# Altium schematic sheet MCU009A_Connector+IO.SchDoc: Connector+IO
size 431 x 279 mm; Date: Not shown in title block; ApprovedBy: Not shown in title block; CheckedBy: Not shown in title block; Author: Not shown in title block; CompanyName: Not shown in title block; Engineer: Not shown in title block; Organization: Not shown in title block; Address1: Not shown in title block; Address2: Not shown in title block; Address3: Not shown in title block; Address4: Not shown in title block; DocumentNumber: 2; Revision: Use project parameter SCH_Rev; SheetNumber: 2; SheetTotal: 7; PageSetup: Record=PageOptions|CenterHorizontal=True|CenterVertical=True|PrintScale=1.00|XCorrection=1.00|YCorrection=1.00|PrintKind=0|BorderSize=5000000|LeftOffset=0|BottomOffset=0|Orientation=2|PaperLength=1000|PaperWidth=1000|Scale=100|PaperSource=15|PrintQuality=600|MediaType=1|DitherType=10|PaperKind=Letter|PrintScaleMode=1; CurrentTime: Not shown in title block; CurrentDate: Not shown in title block; Time: Not shown in title block; DocumentFullPathAndName: Not shown in title block; DocumentName: Not shown in title block; ModifiedDate: Not shown in title block; ImagePath: Not shown in title block
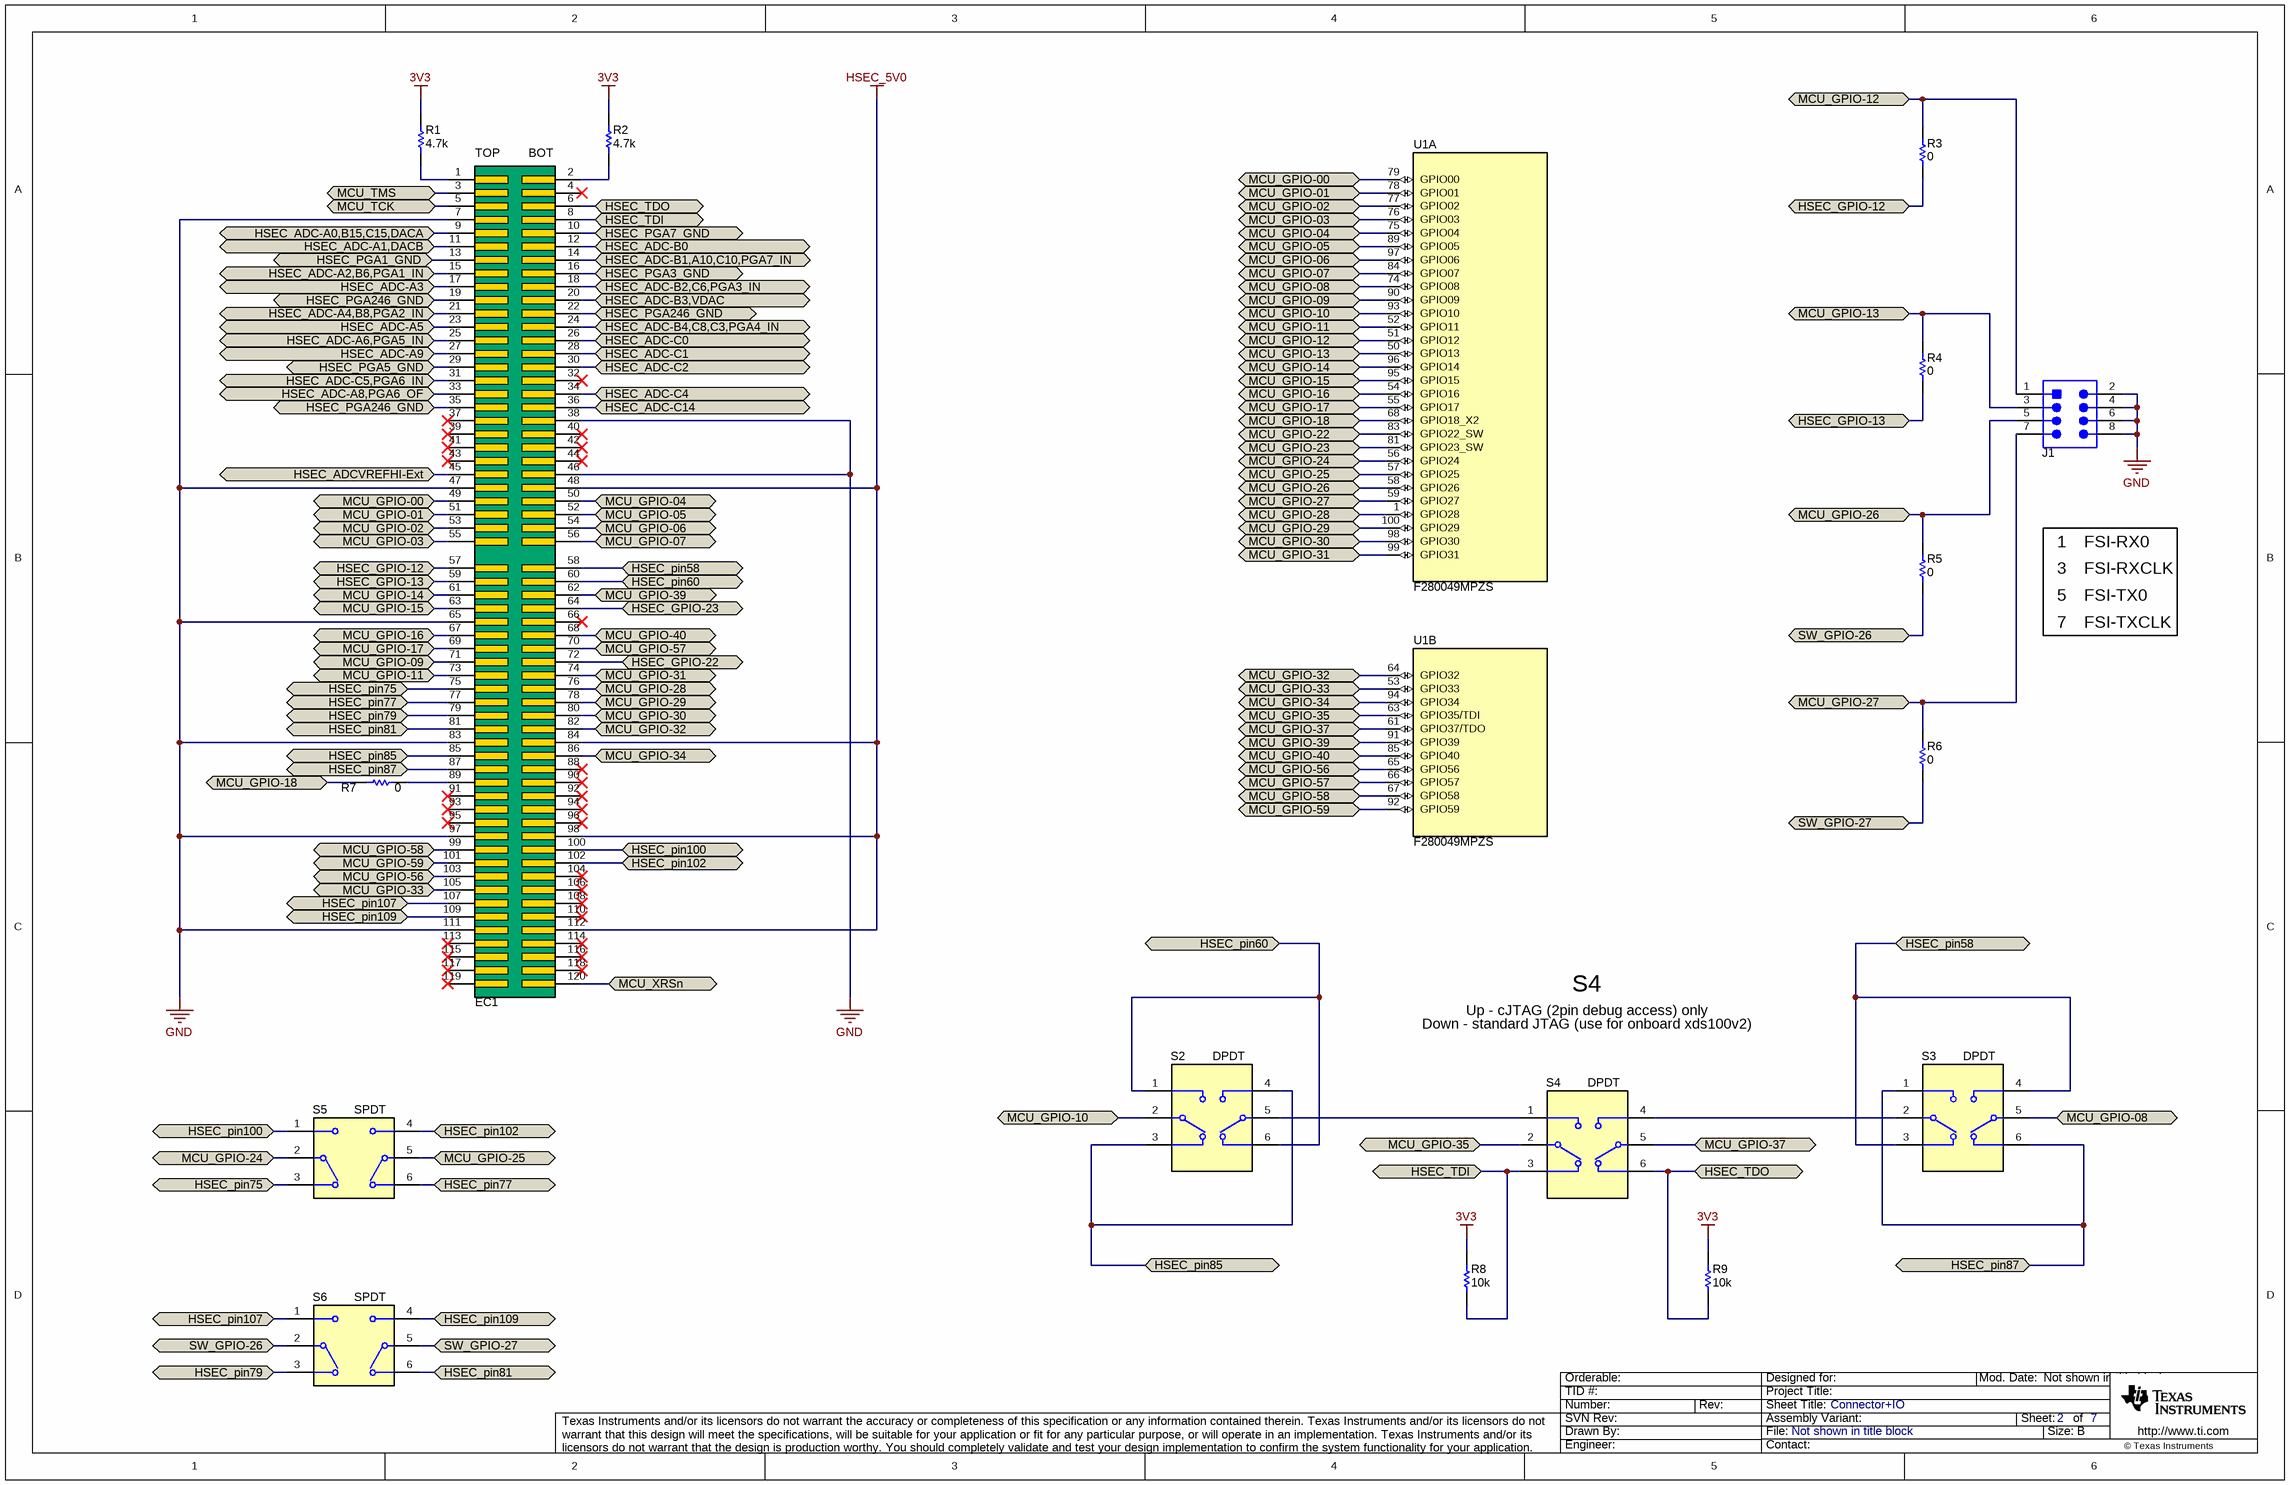
[diagram p0: MCU009A_Connector+IO.SchDoc]

## Parts
EC1  controlCARD-120HSEC_Edge  [controlCARD-120HSEC_Edge]  (value not drawn)  (no BOM)
J1  TMM-104-01-T-D  [Samtec_TMM-104-01-x-D]  (value not drawn)
R1  ValueDisplayed: 4.7k  [0402]  (hidden comment: CRCW04024K70JNED)
R2  ValueDisplayed: 4.7k  [0402]  (hidden comment: CRCW04024K70JNED)
R3  ValueDisplayed: 0  [0603]  (hidden comment: CRCW06030000Z0EA)
R4  ValueDisplayed: 0  [0603]  (hidden comment: CRCW06030000Z0EA)
R5  ValueDisplayed: 0  [0603]  (hidden comment: CRCW06030000Z0EA)
R6  ValueDisplayed: 0  [0603]  (hidden comment: CRCW06030000Z0EA)
R7  ValueDisplayed: 0  [0603]  (hidden comment: CRCW06030000Z0EA)
R8  ValueDisplayed: 10k  [0402]  (hidden comment: CRCW040210K0JNED)
R9  ValueDisplayed: 10k  [0402]  (hidden comment: CRCW040210K0JNED)
S2  Circuit: DPDT  [SW_CAS-220TA]  (hidden comment: CAS-220TA)
S3  Circuit: DPDT  [SW_CAS-220TA]  (hidden comment: CAS-220TA)
S4  Circuit: DPDT  [SW_CAS-220TA]  (hidden comment: CAS-220TA)
S5  Circuit: SPDT  [SW_CAS-D20TA]  (hidden comment: CAS-D20TA)
S6  Circuit: SPDT  [SW_CAS-D20TA]  (hidden comment: CAS-D20TA)
U1  F280049MPZS  [PZ0100A_N]  (parts A,B of 5)

## Ports
HSEC_ADC-A0,B15,C15,DACA (bidir), HSEC_ADC-A1,DACB (bidir), HSEC_ADC-A2,B6,PGA1_IN (bidir), HSEC_ADC-A3 (bidir), HSEC_ADC-A4,B8,PGA2_IN (bidir), HSEC_ADC-A5 (bidir), HSEC_ADC-A6,PGA5_IN (bidir), HSEC_ADC-A8,PGA6_OF (bidir), HSEC_ADC-A9 (bidir), HSEC_ADC-B0 (bidir), HSEC_ADC-B1,A10,C10,PGA7_IN (bidir), HSEC_ADC-B2,C6,PGA3_IN (bidir), HSEC_ADC-B3,VDAC (bidir), HSEC_ADC-B4,C8,C3,PGA4_IN (bidir), HSEC_ADC-C0 (bidir), HSEC_ADC-C1 (bidir), HSEC_ADC-C2 (bidir), HSEC_ADC-C4 (bidir), HSEC_ADC-C5,PGA6_IN (bidir), HSEC_ADC-C14 (bidir), HSEC_ADCVREFHI-Ext (bidir), HSEC_GPIO-12 (bidir), HSEC_GPIO-13 (bidir), HSEC_GPIO-22 (bidir), HSEC_GPIO-23 (bidir), HSEC_PGA1_GND (bidir), HSEC_PGA3_GND (bidir), HSEC_PGA5_GND (bidir), HSEC_PGA7_GND (bidir), HSEC_PGA246_GND (bidir), HSEC_pin58 (bidir), HSEC_pin60 (bidir), HSEC_pin75 (bidir), HSEC_pin77 (bidir), HSEC_pin79 (bidir), HSEC_pin81 (bidir), HSEC_pin85 (bidir), HSEC_pin87 (bidir), HSEC_pin100 (bidir), HSEC_pin102 (bidir), HSEC_pin107 (bidir), HSEC_pin109 (bidir), HSEC_TDI (bidir), HSEC_TDO (bidir), MCU_GPIO-00 (bidir), MCU_GPIO-01 (bidir), MCU_GPIO-02 (bidir), MCU_GPIO-03 (bidir), MCU_GPIO-04 (bidir), MCU_GPIO-05 (bidir), MCU_GPIO-06 (bidir), MCU_GPIO-07 (bidir), MCU_GPIO-08 (bidir), MCU_GPIO-09 (bidir), MCU_GPIO-10 (bidir), MCU_GPIO-11 (bidir), MCU_GPIO-12 (bidir), MCU_GPIO-13 (bidir), MCU_GPIO-14 (bidir), MCU_GPIO-15 (bidir), MCU_GPIO-16 (bidir), MCU_GPIO-17 (bidir), MCU_GPIO-18 (bidir), MCU_GPIO-22 (bidir), MCU_GPIO-23 (bidir), MCU_GPIO-24 (bidir), MCU_GPIO-25 (bidir), MCU_GPIO-26 (bidir), MCU_GPIO-27 (bidir), MCU_GPIO-28 (bidir), MCU_GPIO-29 (bidir), MCU_GPIO-30 (bidir), MCU_GPIO-31 (bidir), MCU_GPIO-32 (bidir), MCU_GPIO-33 (bidir), MCU_GPIO-34 (bidir), MCU_GPIO-35 (bidir), MCU_GPIO-37 (bidir), MCU_GPIO-39 (bidir), MCU_GPIO-40 (bidir), MCU_GPIO-56 (bidir), MCU_GPIO-57 (bidir), MCU_GPIO-58 (bidir), MCU_GPIO-59 (bidir), MCU_TCK (bidir), MCU_TMS (bidir), MCU_XRSn (bidir), SW_GPIO-26 (bidir), SW_GPIO-27 (bidir)

## Nets
3V3: R1.1 R2.2 R8.2 R9.2
GND: EC1.7 EC1.38 EC1.46 EC1.47 EC1.65 EC1.83 EC1.97 EC1.111 J1.2 J1.4 J1.6 J1.8
HSEC_5V0: EC1.48 EC1.84 EC1.98 EC1.112
HSEC_ADC-A0,B15,C15,DACA: EC1.9 ; port HSEC_ADC-A0,B15,C15,DACA
HSEC_ADC-A1,DACB: EC1.11 ; port HSEC_ADC-A1,DACB
HSEC_ADC-A2,B6,PGA1_IN: EC1.15 ; port HSEC_ADC-A2,B6,PGA1_IN
HSEC_ADC-A3: EC1.17 ; port HSEC_ADC-A3
HSEC_ADC-A4,B8,PGA2_IN: EC1.21 ; port HSEC_ADC-A4,B8,PGA2_IN
HSEC_ADC-A5: EC1.23 ; port HSEC_ADC-A5
HSEC_ADC-A6,PGA5_IN: EC1.25 ; port HSEC_ADC-A6,PGA5_IN
HSEC_ADC-A8,PGA6_OF: EC1.33 ; port HSEC_ADC-A8,PGA6_OF
HSEC_ADC-A9: EC1.27 ; port HSEC_ADC-A9
HSEC_ADC-B0: EC1.12 ; port HSEC_ADC-B0
HSEC_ADC-B1,A10,C10,PGA7_IN: EC1.14 ; port HSEC_ADC-B1,A10,C10,PGA7_IN
HSEC_ADC-B2,C6,PGA3_IN: EC1.18 ; port HSEC_ADC-B2,C6,PGA3_IN
HSEC_ADC-B3,VDAC: EC1.20 ; port HSEC_ADC-B3,VDAC
HSEC_ADC-B4,C8,C3,PGA4_IN: EC1.24 ; port HSEC_ADC-B4,C8,C3,PGA4_IN
HSEC_ADC-C0: EC1.26 ; port HSEC_ADC-C0
HSEC_ADC-C1: EC1.28 ; port HSEC_ADC-C1
HSEC_ADC-C2: EC1.30 ; port HSEC_ADC-C2
HSEC_ADC-C4: EC1.34 ; port HSEC_ADC-C4
HSEC_ADC-C5,PGA6_IN: EC1.31 ; port HSEC_ADC-C5,PGA6_IN
HSEC_ADC-C14: EC1.36 ; port HSEC_ADC-C14
HSEC_ADCVREFHI-Ext: EC1.45 ; port HSEC_ADCVREFHI-Ext
HSEC_GPIO-12: EC1.57 R3.1 ; port HSEC_GPIO-12
HSEC_GPIO-13: EC1.59 R4.1 ; port HSEC_GPIO-13
HSEC_GPIO-22: EC1.72 ; port HSEC_GPIO-22
HSEC_GPIO-23: EC1.64 ; port HSEC_GPIO-23
HSEC_PGA1_GND: EC1.13 ; port HSEC_PGA1_GND
HSEC_PGA3_GND: EC1.16 ; port HSEC_PGA3_GND
HSEC_PGA5_GND: EC1.29 ; port HSEC_PGA5_GND
HSEC_PGA7_GND: EC1.10 ; port HSEC_PGA7_GND
HSEC_PGA246_GND: EC1.19 EC1.22 EC1.35 ; port HSEC_PGA246_GND
HSEC_pin58: EC1.58 S3.3 S3.4 ; port HSEC_pin58
HSEC_pin60: EC1.60 S2.1 S2.6 ; port HSEC_pin60
HSEC_pin75: EC1.75 S5.3 ; port HSEC_pin75
HSEC_pin77: EC1.77 S5.6 ; port HSEC_pin77
HSEC_pin79: EC1.79 S6.3 ; port HSEC_pin79
HSEC_pin81: EC1.81 S6.6 ; port HSEC_pin81
HSEC_pin85: EC1.85 S2.3 S2.4 ; port HSEC_pin85
HSEC_pin87: EC1.87 S3.1 S3.6 ; port HSEC_pin87
HSEC_pin100: EC1.100 S5.1 ; port HSEC_pin100
HSEC_pin102: EC1.102 S5.4 ; port HSEC_pin102
HSEC_pin107: EC1.107 S6.1 ; port HSEC_pin107
HSEC_pin109: EC1.109 S6.4 ; port HSEC_pin109
HSEC_TDI: EC1.8 R8.1 S4.3 ; port HSEC_TDI
HSEC_TDO: EC1.6 R9.1 S4.6 ; port HSEC_TDO
MCU_GPIO-00: EC1.49 U1.79(GPIO00) ; port MCU_GPIO-00
MCU_GPIO-01: EC1.51 U1.78(GPIO01) ; port MCU_GPIO-01
MCU_GPIO-02: EC1.53 U1.77(GPIO02) ; port MCU_GPIO-02
MCU_GPIO-03: EC1.55 U1.76(GPIO03) ; port MCU_GPIO-03
MCU_GPIO-04: EC1.50 U1.75(GPIO04) ; port MCU_GPIO-04
MCU_GPIO-05: EC1.52 U1.89(GPIO05) ; port MCU_GPIO-05
MCU_GPIO-06: EC1.54 U1.97(GPIO06) ; port MCU_GPIO-06
MCU_GPIO-07: EC1.56 U1.84(GPIO07) ; port MCU_GPIO-07
MCU_GPIO-08: S3.5 U1.74(GPIO08) ; port MCU_GPIO-08
MCU_GPIO-09: EC1.71 U1.90(GPIO09) ; port MCU_GPIO-09
MCU_GPIO-10: S2.2 U1.93(GPIO10) ; port MCU_GPIO-10
MCU_GPIO-11: EC1.73 U1.52(GPIO11) ; port MCU_GPIO-11
MCU_GPIO-12: J1.1 R3.2 U1.51(GPIO12) ; port MCU_GPIO-12
MCU_GPIO-13: J1.3 R4.2 U1.50(GPIO13) ; port MCU_GPIO-13
MCU_GPIO-14: EC1.61 U1.96(GPIO14) ; port MCU_GPIO-14
MCU_GPIO-15: EC1.63 U1.95(GPIO15) ; port MCU_GPIO-15
MCU_GPIO-16: EC1.67 U1.54(GPIO16) ; port MCU_GPIO-16
MCU_GPIO-17: EC1.69 U1.55(GPIO17) ; port MCU_GPIO-17
MCU_GPIO-18: R7.2 U1.68(GPIO18_X2) ; port MCU_GPIO-18
MCU_GPIO-22: U1.83(GPIO22_SW) ; port MCU_GPIO-22
MCU_GPIO-23: U1.81(GPIO23_SW) ; port MCU_GPIO-23
MCU_GPIO-24: S5.2(C) U1.56(GPIO24) ; port MCU_GPIO-24
MCU_GPIO-25: S5.5(C) U1.57(GPIO25) ; port MCU_GPIO-25
MCU_GPIO-26: J1.5 R5.2 U1.58(GPIO26) ; port MCU_GPIO-26
MCU_GPIO-27: J1.7 R6.2 U1.59(GPIO27) ; port MCU_GPIO-27
MCU_GPIO-28: EC1.76 U1.1(GPIO28) ; port MCU_GPIO-28
MCU_GPIO-29: EC1.78 U1.100(GPIO29) ; port MCU_GPIO-29
MCU_GPIO-30: EC1.80 U1.98(GPIO30) ; port MCU_GPIO-30
MCU_GPIO-31: EC1.74 U1.99(GPIO31) ; port MCU_GPIO-31
MCU_GPIO-32: EC1.82 U1.64(GPIO32) ; port MCU_GPIO-32
MCU_GPIO-33: EC1.105 U1.53(GPIO33) ; port MCU_GPIO-33
MCU_GPIO-34: EC1.86 U1.94(GPIO34) ; port MCU_GPIO-34
MCU_GPIO-35: S4.2 U1.63(GPIO35/TDI) ; port MCU_GPIO-35
MCU_GPIO-37: S4.5 U1.61(GPIO37/TDO) ; port MCU_GPIO-37
MCU_GPIO-39: EC1.62 U1.91(GPIO39) ; port MCU_GPIO-39
MCU_GPIO-40: EC1.68 U1.85(GPIO40) ; port MCU_GPIO-40
MCU_GPIO-56: EC1.103 U1.65(GPIO56) ; port MCU_GPIO-56
MCU_GPIO-57: EC1.70 U1.66(GPIO57) ; port MCU_GPIO-57
MCU_GPIO-58: EC1.99 U1.67(GPIO58) ; port MCU_GPIO-58
MCU_GPIO-59: EC1.101 U1.92(GPIO59) ; port MCU_GPIO-59
MCU_TCK: EC1.5 ; port MCU_TCK
MCU_TMS: EC1.3 ; port MCU_TMS
MCU_XRSn: EC1.120 ; port MCU_XRSn
SW_GPIO-26: R5.1 S6.2(C) ; port SW_GPIO-26
SW_GPIO-27: R6.1 S6.5(C) ; port SW_GPIO-27
NetEC1_1: EC1.1 R1.2
NetEC1_2: EC1.2 R2.1
NetEC1_89: EC1.89 R7.1
NetS2_5: S2.5 S4.1
NetS3_2: S3.2 S4.4

Not connected (* = marked no-connect by the designer): EC1 4* 32* 37* 39* 40* 41* 42* 43* 44* 66* 88* 90* 91* 92* 93* 94* 95* 96* 104* 106* 108* 110* 113* 114* 115* 116* 117* 118* 119*

## Notes on the sheet
- 1
- 3
- FSI-RX0
- FSI-RXCLK
- 5
- 7
- FSI-TX0
- FSI-TXCLK
- S4
- Up - cJTAG (2pin debug access) only
- Down - standard JTAG (use for onboard xds100v2)
- Drawn By:
- SVN Rev:
- Number:
- TID #:
- Orderable:
- Rev:
- Sheet Title:
- File:
- Project Title:
- Designed for:
- Assembly Variant:
- Mod. Date:
- Sheet:
- Size:
- of
- B
- http://www.ti.com
- Texas Instruments and/or its licensors do not warrant the accuracy or completeness of this specification or any information contained therein. Texas Instruments and/or its licensors do not warrant that this design will meet the specifications, will be suitable for your application or fit for any particular purpose, or will operate in an implementation. Texas Instruments and/or its licensors do not warrant that the design is production worthy. You should completely validate and test your design implementation to confirm the system functionality for your application.
- Engineer:
- Contact:
- © Texas Instruments
- (in symbol controlCARD-120HSEC_Edge) TOP; BOT

## Library data of the parts
EC1 = controlCARD-120HSEC_Edge: C2000 controlCARD-120HSEC Edge Connector for Samtec HSEC8-160-01-L-DV-A-BL; Manufacturer: Any; SymbolCreator: a0412235; Note: The pin numbering does not match Samtec datasheet; SymbolVersion: 2015-09-21; CompType: Edge Connector; PartNumber: controlCARD-120HSEC_Edge; PackageReference: C2000 pin numbering for edge connetor; MountType: N/A; Publisher: Texas Instruments; LatestRevisionDate: 2016-10-03
J1 = TMM-104-01-T-D: Header, 2mm, 4x2, Tin, TH; Manufacturer: Samtec; SymbolCreator: a0411947; Pitch_mm: 2; Gender: Male; Shrouded: N; Current_A: 3.2; Cert_CSA: Y; SymbolVersion: 2013-12-22; PartNumber: TMM-104-01-T-D; PackageReference: Header, 2mm, 4x2, TH; ClassName: Header; CompType: Header; RoHS: Y; MountType: TH; ComponentLink1Description: Datasheet URL; ComponentLink1URL: http://suddendocs.samtec.com/catalog_english/tmm_th.pdf; Orientation: Vertical; PinCount: 8; Row_Count: 2; RowSpacing_mm: 2; ContactFinish: Tin; Color: Black; Cert_UL: Y; Publisher: Texas Instruments; LatestRevisionDate: 2016-10-17; Supplier 1: Digi-Key; Supplier Part Number 1: SAM1177-04-ND
R1 R2 = CRCW04024K70JNED: RES, 4.7 k, 5%, 0.063 W, 0402; Manufacturer: Vishay-Dale; CompType: Resistor; Value: 4.7k; Res_ohm: 4700; Value_Code: 4k70; Tolerance_%: 5; Power_W: 0.063; Value2: 0.063W; VDC_V: 50; TempCo: 200 ppm/C; EIA_Code: E24; U/M: EA; AEC Category: Q200; SizeArea_mm2: 0.5; SizeX_mm: 1; SizeZ_mm: 0.6; SymbolVersion: 2009-05-29; PartNumber: CRCW04024K70JNED; PackageReference: 0402; RoHS: Y; Value1: 5%; MountType: SMT; Technology: Thick Film; Published: 2008-06-26; Publisher: Texas Instruments; LatestRevisionDate: 2016-10-03; ComponentLink1Description: Datasheet link; ComponentLink1URL: http://www.vishay.com/docs/20035/dcrcwe3.pdf; Supplier 1: Digi-Key; Supplier Part Number 1: 541-4.7KJCT-ND; Supplier 2: Mouser; Supplier Part Number 2: 71-CRCW0402J-4.7K-E3; Supplier 3: Farnell; Supplier Part Number 3: 1514704; AEC Qualified: ?; SizeY_mm: 0.5
R3-R7 = CRCW06030000Z0EA: RES, 0, 5%, 0.1 W, 0603; Manufacturer: Vishay-Dale; CompType: Resistor; Value: 0; Value_Code: 0000; Tolerance_%: 5; Power_W: 0.1; Value2: 0.1W; VDC_V: 75; TempCo: 200 ppm/C; EIA_Code: E24; U/M: EA; AEC Category: Q200; SizeArea_mm2: 1.28; SizeX_mm: 1.6; SizeY_mm: 0.8; SizeZ_mm: 1; SymbolVersion: 2009-05-29; PartNumber: CRCW06030000Z0EA; PackageReference: 0603; RoHS: Y; Res_ohm: 0; Value1: 5%; MountType: SMT; Technology: Thick Film; Published: 2008-06-26; Publisher: Texas Instruments; LatestRevisionDate: 2016-10-03; ComponentLink1Description: Datasheet link; ComponentLink1URL: http://www.vishay.com/docs/20035/dcrcwe3.pdf; Supplier 1: Digi-Key; Supplier Part Number 1: 541-0.0GCT-ND; Supplier 2: Mouser; Supplier Part Number 2: 71-CRCW0603-0-E3; Supplier 3: Farnell; Supplier Part Number 3: 1469739; AEC Qualified: ?
R8 R9 = CRCW040210K0JNED: RES, 10 k, 5%, 0.063 W, 0402; Manufacturer: Vishay-Dale; CompType: Resistor; Value: 10k; Res_ohm: 10000; Value_Code: 10k0; Tolerance_%: 5; Power_W: 0.063; Value2: 0.063W; VDC_V: 50; TempCo: 200 ppm/C; EIA_Code: E24; U/M: EA; AEC Category: Q200; SizeArea_mm2: 0.5; SizeX_mm: 1; SizeZ_mm: 0.6; SymbolVersion: 2009-05-29; PartNumber: CRCW040210K0JNED; PackageReference: 0402; RoHS: Y; Value1: 5%; MountType: SMT; Technology: Thick Film; Published: 2008-06-26; Publisher: Texas Instruments; LatestRevisionDate: 2016-10-03; ComponentLink1Description: Datasheet link; ComponentLink1URL: http://www.vishay.com/docs/20035/dcrcwe3.pdf; Supplier 1: Digi-Key; Supplier Part Number 1: 541-10KJCT-ND; Supplier 2: Mouser; Supplier Part Number 2: 71-CRCW0402J-10K-E3; Supplier 3: Farnell; Supplier Part Number 3: 1514663; AEC Qualified: ?; SizeY_mm: 0.5
S2-S4 = CAS-220TA: SLIDE SWITCH DPDT  .1A, SMT; Manufacturer: Copal Electronics; SymbolCreator: a0411947; VDC_V: 6; SwitchFunction: On-On; PositionCount: 2; CurrentRating_mA: 100; SymbolVersion: 2016-1-26; PartNumber: CAS-220TA; MountType: SMT; ComponentLink1Description: Datasheet URL; ComponentLink1URL: http://copal-electronics.info/en/0008e/02462.pdf; RoHS: Y; Orientation: Horizontal; CompType: Switch; PackageReference: SWITCH, 5.4x2.5x3.9mm; Publisher: Texas Instruments; LatestRevisionDate: 2016-10-04; Supplier 1: Digi-Key; Supplier Part Number 1: CAS220JCT-ND
S5 S6 = CAS-D20TA: Switch, Dual SPDT,  2 Pos, 0.1A, 6VDC, SMD; Manufacturer: Copal Electronics; SymbolCreator: Altium; VDC_V: 6; SwitchFunction: On-On; PositionCount: 2; CurrentRating_mA: 100; SymbolVersion: 2015-06-08; PartNumber: CAS-D20TA; MountType: SMT; ComponentLink1Description: Datasheet Link; ComponentLink1URL: http://www.nidec-copal-electronics.com/e/catalog/switch/cas.pdf; RoHS: Y; Orientation: Top Actuated; CompType: Switch; PackageReference: 5.4x3.9mm; Publisher: Texas Instruments; LatestRevisionDate: 2016-10-04; Supplier 1: Digi-Key; Supplier Part Number 1: CASD20JCT-ND
U1 = F280049MPZS: Piccolo Microcontroller, PZ0100A (LQFP-100); Manufacturer: Texas Instruments; SymbolCreator: Altium; SizeArea_mm2: 256; SizeAreaWB_mm2: 324; SizeX_mm: 16; SizeZ_mm: 1.6; CompType: IC; U/M: EA; SymbolVersion: 2016-08-22; PartNumber: F280049MPZS; PackageReference: PZ0100A; PackageDescription: LQFP-100; MountType: SMT; SizeY_mm: 16; ComponentLink1Description: Datasheet Link; ComponentLink1URL: https://sps06.itg.ti.com/sites/KMS/crossdivteams/altium/docs/ComponentDatasheets/Potenza-DS-June30.pdf; Publisher: Texas Instruments; LatestRevisionDate: 2016-10-04; Alternate Manufacturer: Texas Instruments